# EAGLE schematic CarteMoteur (EAGLE 4.08)
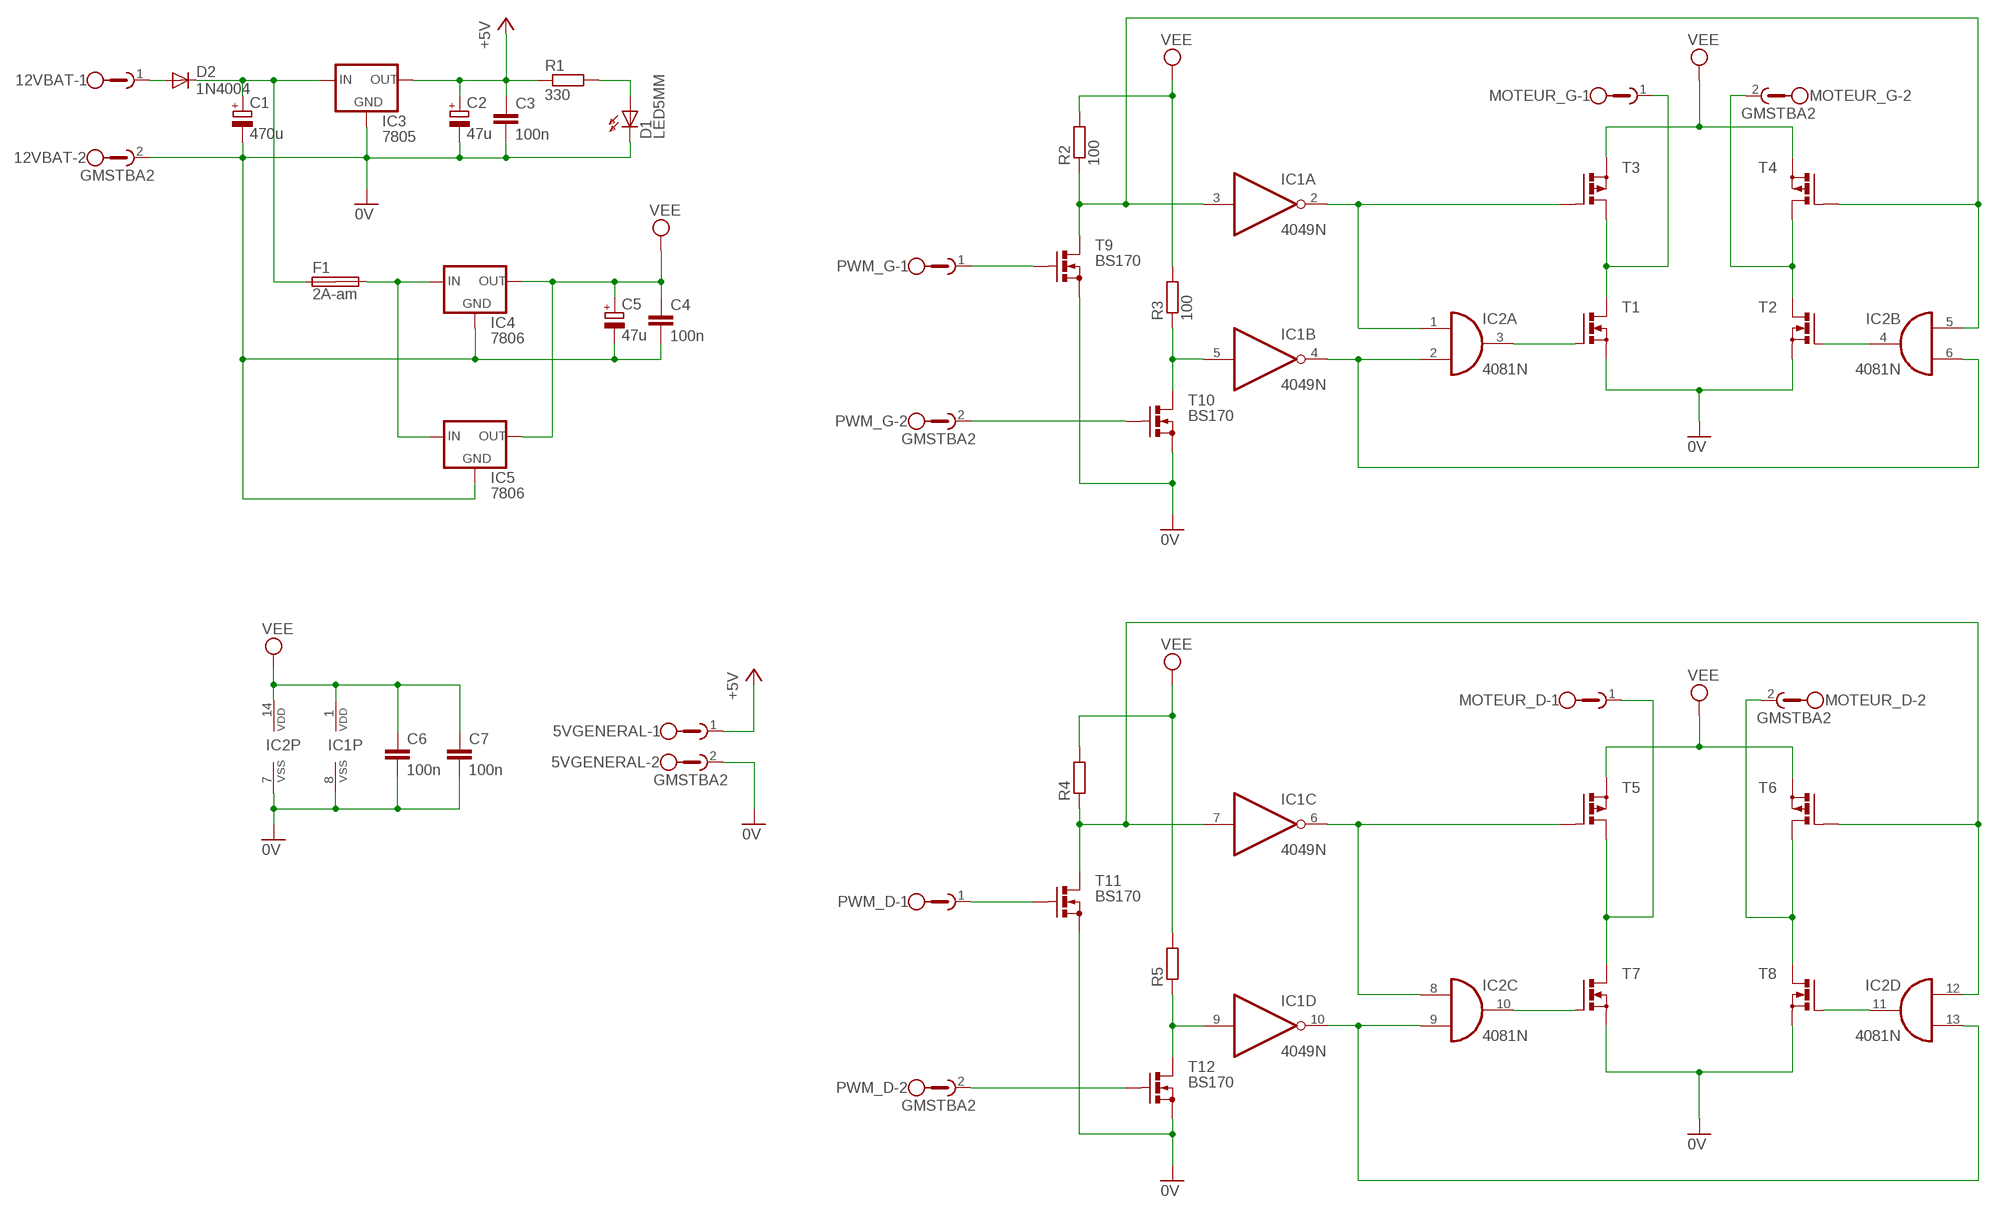
[diagram p0: schematic, sheet 1]

## Parts
5VGENERAL  GMSTBA2  [GMSTBA2]
12VBAT  GMSTBA2  [GMSTBA2]
C1  470u  CPOL-EUE2-4  [E2-4]
C2  47u  CPOL-EUE2-4  [E2-4]
C3  100n  C-EU025-025X050  [C025-025X050]
C4  100n  C-EU025-025X050  [C025-025X050]
C5  47u  CPOL-EUE2-4  [E2-4]
C6  100n  C-EU025-025X050  [C025-025X050]
C7  100n  C-EU025-025X050  [C025-025X050]
D1  LED5MM  [LED5MM]
D2  1N4004  [DO41-10]
F1  2A-am  SHK20L  [SHK20L]
IC1  4049N  [DIL16]
IC2  4081N  [DIL14]
IC3  7805  78XXS  [78XXS]
IC4  7806  78XXS  [78XXS]
IC5  7806  78XXS  [78XXS]
MOTEUR_D  GMSTBA2  [GMSTBA2]
MOTEUR_G  GMSTBA2  [GMSTBA2]
PWM_D  GMSTBA2  [GMSTBA2]
PWM_G  GMSTBA2  [GMSTBA2]
R1  330  R-EU_0207/2V  [0207/2V]
R2  100  R-EU_0207/2V  [0207/2V]
R3  100  R-EU_0207/2V  [0207/2V]
R4  R-EU_0207/2V  [0207/2V]
R5  R-EU_0207/2V  [0207/2V]
T1  PMOSFET_NTO220BV  [TO220BV]
T2  PMOSFET_NTO220BV  [TO220BV]
T3  PMOSFET_PTO220BV  [TO220BV]
T4  PMOSFET_PTO220BV  [TO220BV]
T5  PMOSFET_PTO220BV  [TO220BV]
T6  PMOSFET_PTO220BV  [TO220BV]
T7  PMOSFET_NTO220BV  [TO220BV]
T8  PMOSFET_NTO220BV  [TO220BV]
T9  BS170  [SOT54E]
T10  BS170  [SOT54E]
T11  BS170  [SOT54E]
T12  BS170  [SOT54E]

## Nets
0V: 5VGENERAL.2 12VBAT.2 C1.- C2.- C3.2 C4.2 C5.- C6.2 C7.2 D1.K(C) IC1.8(P:VSS) IC2.7(P:VSS) IC3.GND IC4.GND IC5.GND T1.S T2.S T7.S T8.S T11.S T12.S
+5V: 5VGENERAL.1 C2.+ C3.1 IC3.OUT R1.1
N$1: 12VBAT.1 D2.A
N$2: C1.+ D2.C F1.1A IC3.IN
N$3: IC1.3(A:I) IC2.5(B:I0) R2.1 T4.G T9.D
N$4: IC2.4(B:O) T2.G
N$5: F1.2A IC4.IN IC5.IN
N$6: IC1.4(B:O) IC2.2(A:I1) IC2.6(B:I1)
N$7: MOTEUR_G.1 T1.D T3.D
N$8: MOTEUR_G.2 T2.D T4.D
N$9: D1.A R1.2
N$10: IC1.5(B:I) R3.1 T10.D
N$12: IC1.6(C:O) IC2.8(C:I0) T5.G
N$14: IC2.3(A:O) T1.G
N$15: IC1.2(A:O) IC2.1(A:I0) T3.G
N$16: IC2.10(C:O) T7.G
N$17: T9.S T10.S ; supply symbol labelled 0V
N$18: IC2.11(D:O) T8.G
N$19: IC1.7(C:I) IC2.12(D:I0) R4.1 T6.G T11.D
N$20: PWM_G.1 T9.G
N$21: PWM_G.2 T10.G
N$24: R2.2 R3.2 ; supply symbol labelled VEE
N$26: IC1.10(D:O) IC2.9(C:I1) IC2.13(D:I1)
N$27: IC1.9(D:I) R5.1 T12.D
N$33: PWM_D.1 T11.G
N$34: PWM_D.2 T12.G
N$35: MOTEUR_D.2 T6.D T8.D
N$36: MOTEUR_D.1 T5.D T7.D
VEE: C4.1 C5.+ C6.1 C7.1 IC1.1(P:VDD) IC2.14(P:VDD) IC4.OUT IC5.OUT R4.2 R5.2 T3.S T4.S T5.S T6.S
Unconnected: F1.1B F1.2B IC1.11(E:I) IC1.12(E:O) IC1.14(F:I) IC1.15(F:O)

## Library data of the parts
5VGENERAL 12VBAT MOTEUR_D MOTEUR_G PWM_D PWM_G = con-phoenix-508:GMSTBA2: PHOENIX
C1 C2 C5 = rcl:CPOL-EU: POLARIZED CAPACITOR, European symbol
C3 C4 C6 C7 = rcl:C-EU: CAPACITOR, European symbol
D1 = led:LED5MM: LED 5 mm, round
D2 = diode:1N4004: DIODE general purpose rectifier, 1 A
F1 = fuse:SHK20L: FUSE HOLDER 5 x 20 mm, SH contact, SHH1 Schukat, E1073 Buerklin
IC1 = 40xx:4049: Hex inverting BUFFER
IC2 = 40xx:4081: Quad 2-input AND
IC3-IC5 = v-reg:78XXS: VOLTAGE REGULATOR
R1-R5 = rcl:R-EU_: RESISTOR, European symbol
T1 T2 T7 T8 = transistor-power:PMOSFET_N: Power MOSFET N-Channel
T3-T6 = transistor-power:PMOSFET_P: Power MOSFET P-Channel
T9-T12 = transistor-small-signal:BS170: N-CHANNEL MOS FET